# Altium schematic sheet brс_pl_power_adapter.SchDoc: =GlobalProjectName
size 209 x 297 mm; SheetNumber: 1; SheetTotal: 1; PageSetup: Record=PageOptions|CenterHorizontal=True|CenterVertical=True|PrintScale=1.00|XCorrection=1.00|YCorrection=1.00|PrintKind=1|BorderSize=5000000|LeftOffset=0|BottomOffset=0|Orientation=2|PaperLength=1000|PaperWidth=1000|Scale=100|PaperSource=15|PrintQuality=1200|MediaType=1|DitherType=10|PaperKind=A3|PrintScaleMode=1; Weight: -; ScaleFactor: -
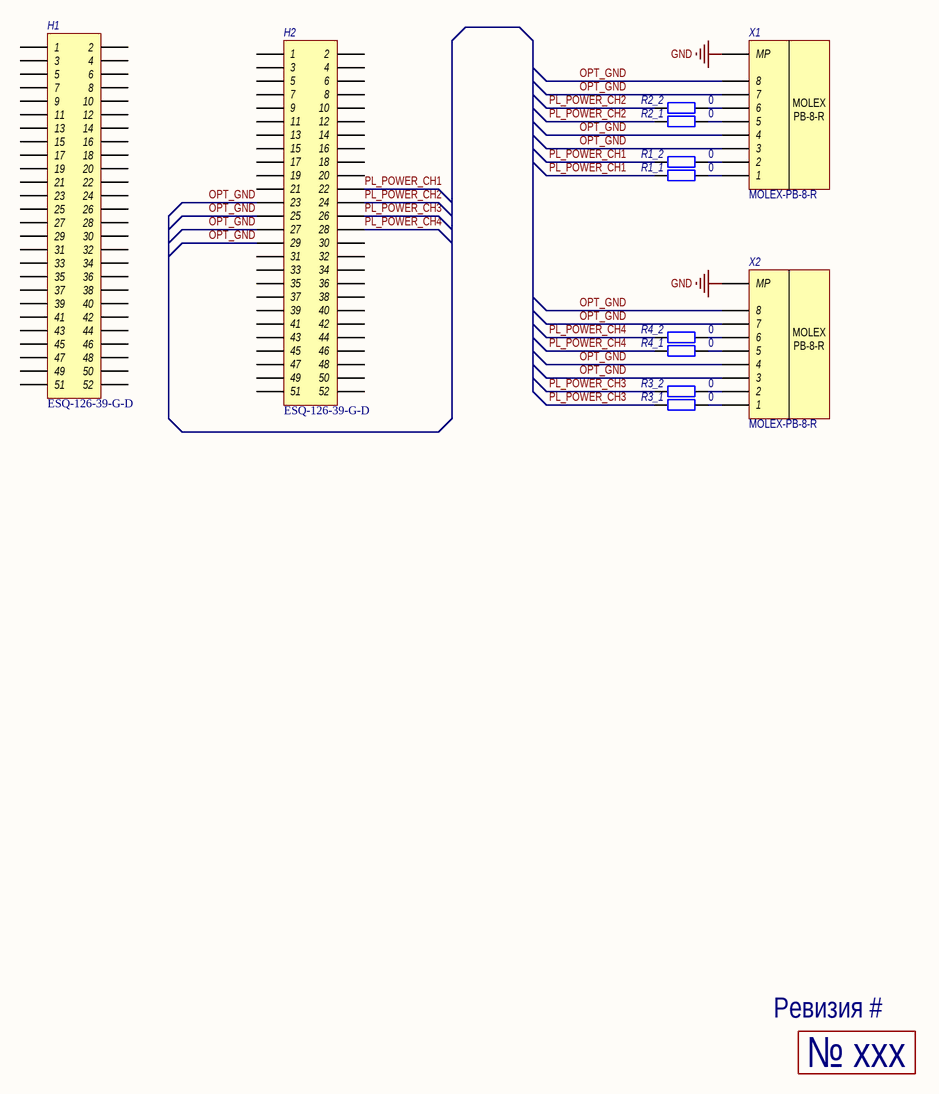
[diagram p0: brс_pl_power_adapter.SchDoc]

## Parts
H1  ESQ-126-39-G-D  [ESQ-126-39-G-D]
H2  ESQ-126-39-G-D  [ESQ-126-39-G-D]
R1_1  value 0  [SMD_0805]  (hidden comment: OSM R1-12)
R1_2  value 0  [SMD_0805]  (hidden comment: OSM R1-12)
R2_1  value 0  [SMD_0805]  (hidden comment: OSM R1-12)
R2_2  value 0  [SMD_0805]  (hidden comment: OSM R1-12)
R3_1  value 0  [SMD_0805]  (hidden comment: OSM R1-12)
R3_2  value 0  [SMD_0805]  (hidden comment: OSM R1-12)
R4_1  value 0  [SMD_0805]  (hidden comment: OSM R1-12)
R4_2  value 0  [SMD_0805]  (hidden comment: OSM R1-12)
SN  Место под нанесение серийного номера  [Serial_number_v3]  (value not drawn)
X1  MOLEX-PB-8  [MOLEX-PB-8-R]  (value not drawn)
X2  MOLEX-PB-8  [MOLEX-PB-8-R]  (value not drawn)

## Nets
GND: X1.MP X2.MP
OPT_GND: H2.23 H2.25 H2.27 H2.29 X1.3 X1.4 X1.7 X1.8 X2.3 X2.4 X2.7 X2.8
PL_POWER_CH1: H2.22 R1_1.1 R1_2.1
PL_POWER_CH2: H2.24 R2_1.1 R2_2.1
PL_POWER_CH3: H2.26 R3_1.1 R3_2.1
PL_POWER_CH4: H2.28 R4_1.1 R4_2.1
NetR1_1_2: R1_1.2 X1.1
NetR1_2_2: R1_2.2 X1.2
NetR2_1_2: R2_1.2 X1.5
NetR2_2_2: R2_2.2 X1.6
NetR3_1_2: R3_1.2 X2.1
NetR3_2_2: R3_2.2 X2.2
NetR4_1_2: R4_1.2 X2.5
NetR4_2_2: R4_2.2 X2.6

Not connected (* = marked no-connect by the designer): H1 1 2 3 4 5 6 7 8 9 10 11 12 13 14 15 16 17 18 19 20 21 22 23 24 25 26 27 28 29 30 31 32 33 34 35 36 37 38 39 40 41 42 43 44 45 46 47 48 49 50 51 52; H2 1 2 3 4 5 6 7 8 9 10 11 12 13 14 15 16 17 18 19 20 21 30 31 32 33 34 35 36 37 38 39 40 41 42 43 44 45 46 47 48 49 50 51 52

## Notes on the sheet
- (near SN) Ревизия #
- Перв. примен.
- Справ. №
- Подп. и дата
- Инв. № дубл.
- Взам. инв. №
- Разраб.
- Изм.
- Лист
- № докум.
- Подп.
- Дата
- Литера
- Масса
- Масштаб
- Пров.
- Т.контр.
- Листов
- Инв. № подл.
- Н.контр.
- Утв.
- Форма 1 ГОСТ 2.104-2006
- Копировал
- Формат А4
- (in symbol MOLEX-PB-8) MOLEX / PB-8-R
- (in symbol Serial_number) № xxx

## Library data of the parts
H1 H2 = ESQ-126-39-G-D: Elevated socket, dual-row, 26-pin per row; Назначение: Сквозной разъем, двойно, 52 контакта, шаг 2,54 мм; Потребление, Вт: 0,00; Наименование: ESQ-126-39-G-D; ComponentLink1Description: DataSheet; ComponentLink1URL: https://static.chipdip.ru/lib/071/DOC025071643.pdf
R1_1 R1_2 R2_1 R2_2 R3_1 R3_2 R4_1 R4_2 = Resistor: Наименование: ОСМ Р1-12; Назначение: SMD-резистор; Потребление, Вт: 0,001; Точность: %
  R1_1 R1_2 R2_1 R2_2: ClassName: Group1
  R3_1 R3_2 R4_1 R4_2: ClassName: Group2
SN = Serial_number: Потребление, Вт: 0; Назначение: Место под нанесение серийного номера; Наименование: Место под нанесение серийного номера
X1 X2 = MOLEX-PB-8: MOLEX PicoBlade 8-pin; Назначение: MOLEX PicoBlade 8-pin to board; Потребление, Вт: 0,001; Наименование: MOLEX-PB-8-R
  X1: ClassName: Group1
  X2: ClassName: Group2